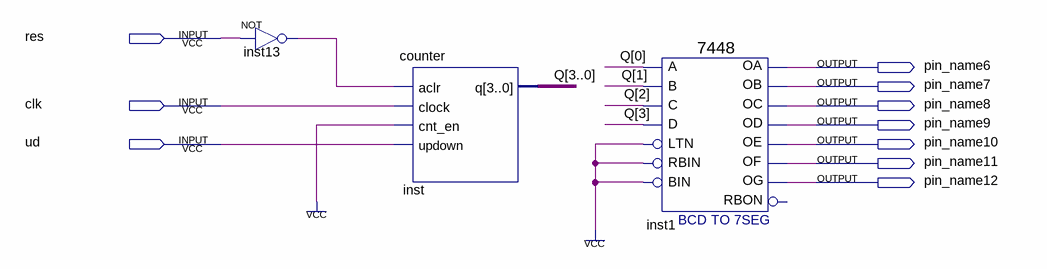
[diagram p0: schematic sheet]
// Quartus schematic ip_smp.bdf as structural Verilog: 3 symbols, 10 pins
module ip_smp (
  input  res,
  input  clk,
  input  ud,
  output pin_name6,
  output pin_name7,
  output pin_name8,
  output pin_name9,
  output pin_name10,
  output pin_name11,
  output pin_name12
);

  wire inst13_out;
  wire [3:0] Q;

  not inst13 (inst13_out, res);
  counter inst (.aclr(inst13_out), .clock(clk), .cnt_en(1'b1), .updown(ud), .q(Q));
  \7448  inst1 (
    .A(Q[0]), .C(Q[2]), .D(Q[3]), .B(Q[1]), .RBIN(1'b1), .BIN(1'b1), .LTN(1'b1), .OC(pin_name8),
    .OE(pin_name10), .OD(pin_name9), .OF(pin_name11), .OG(pin_name12), .OB(pin_name7), .OA(pin_name6));  // open: RBON
endmodule
